# EAGLE schematic lightfun (EAGLE 7.2.0)
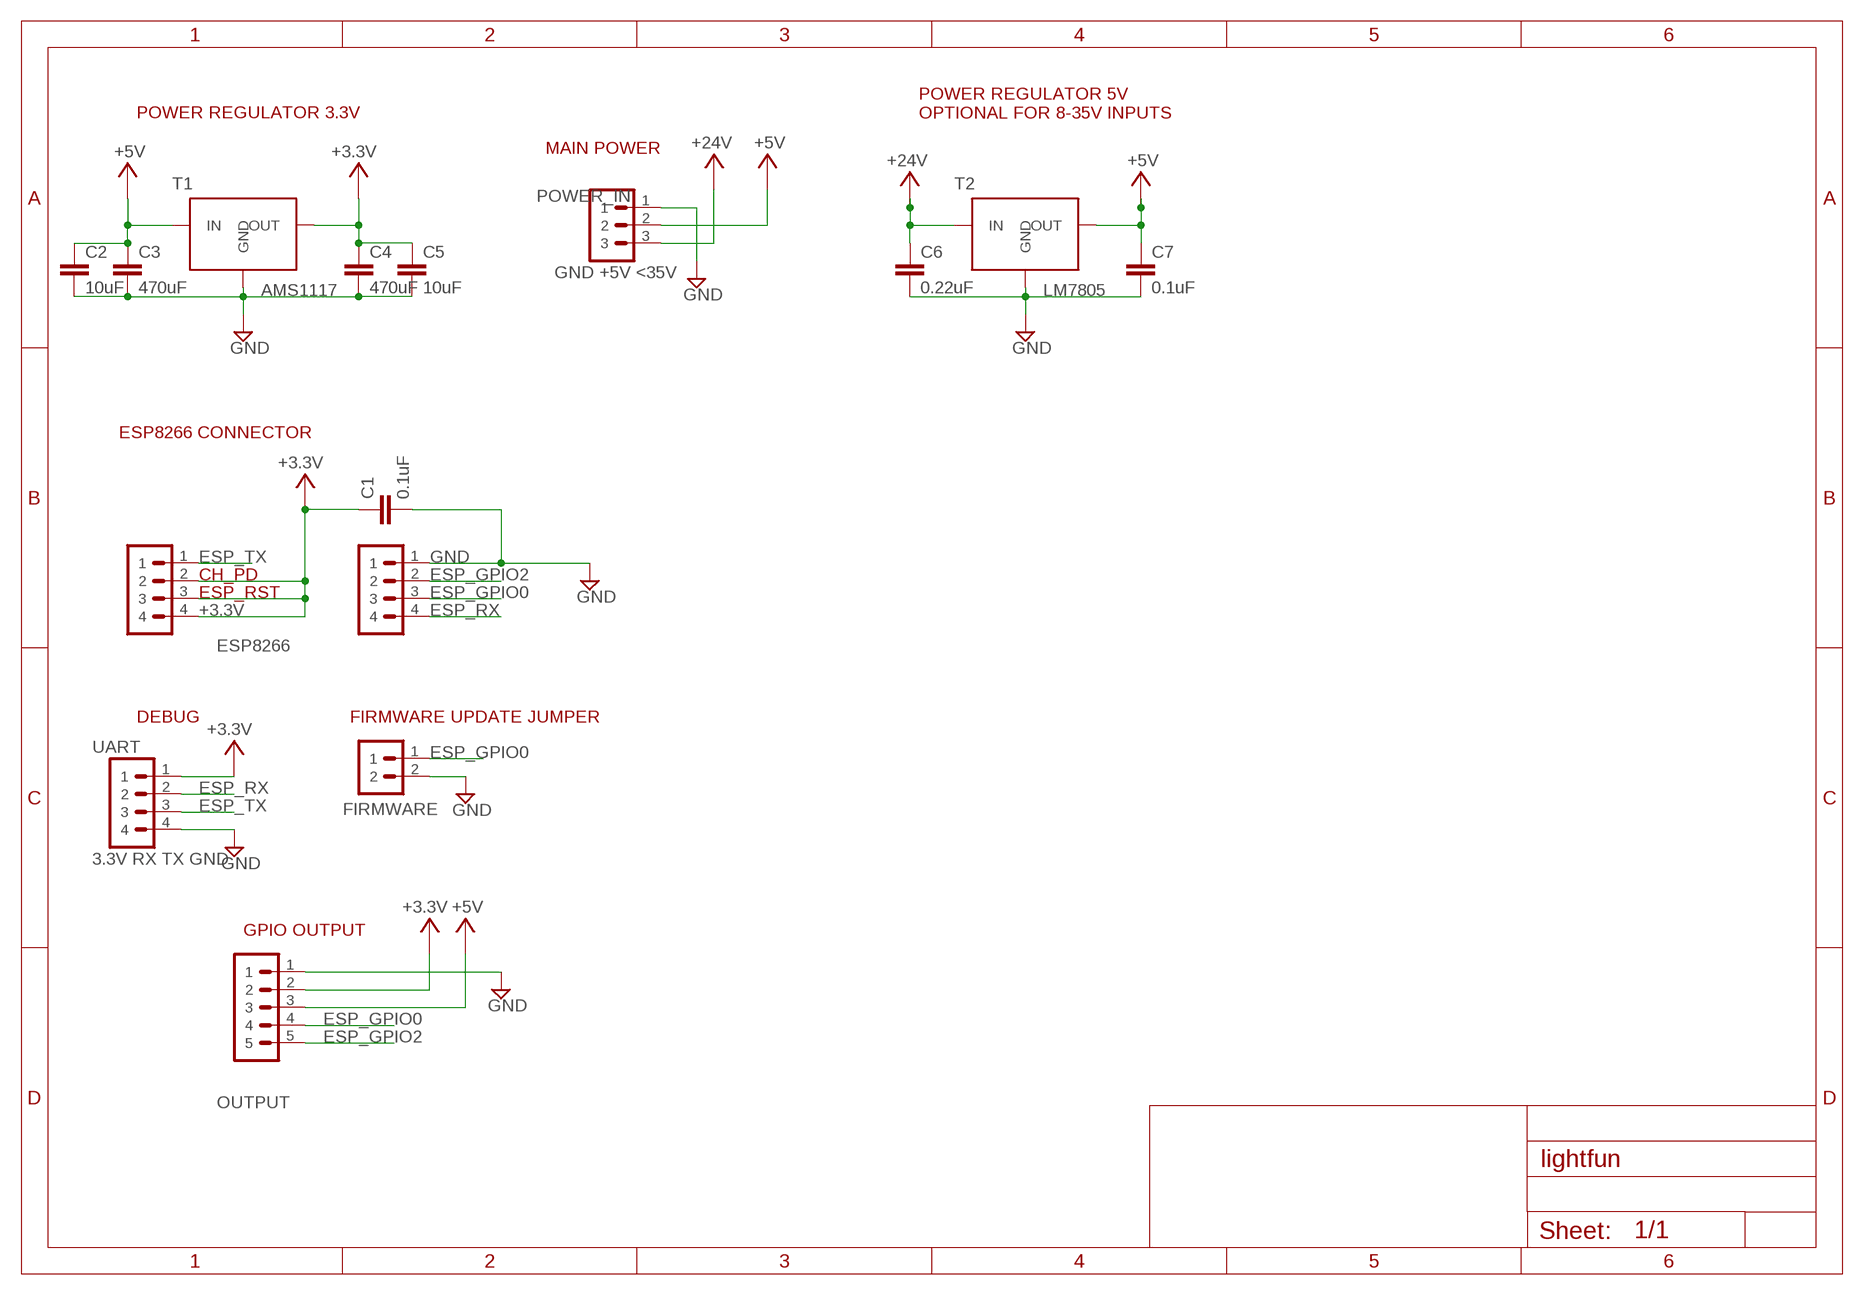
[diagram p0: schematic, sheet 1]

## Parts
C1  0.1uF  C2.5/2  [C2.5-2]
C2  10uF  C2.5/2  [C2.5-2]
C3  470uF  C2.5/2  [C2.5-2]
C4  470uF  C2.5/2  [C2.5-2]
C5  10uF  C2.5/2  [C2.5-2]
C6  0.22uF  C2.5/2  [C2.5-2]
C7  0.1uF  C2.5/2  [C2.5-2]
FIRMWARE  FIRMWARE  PIN-HEADER-2PIN  [PIN-HEADER-2PIN]
OUTPUT  GND 3.3V 5V IO0 IO2  PIN-HEADER-5PIN  [PIN-HEADER-5PIN]
P1  ESP8266  PIN-HEADER-4PIN  [PIN-HEADER-4PIN]
P2  ESP8266 CONNECTOR  PIN-HEADER-4PIN  [PIN-HEADER-4PIN]
POWER_IN  GND +5V <35V  PIN-HEADER-3PIN  [PIN-HEADER-3PIN]
T1  AMS1117  [SOT-223]
T2  LM7805  [TO-220]
UART  3.3V RX TX GND  PIN-HEADER-4PIN  [PIN-HEADER-4PIN]

## Nets
+3.3V [power-2A]: C1.1 C4.1 C5.1 OUTPUT.2 P1.2 P1.3 P1.4 T1.2(OUT) UART.1
+5V [power-2A]: C2.1 C3.1 C7.1 OUTPUT.3 POWER_IN.2 T1.3(IN) T2.OUTPUT(OUT)
+24V [power-2A]: C6.1 POWER_IN.3 T2.INPUT(IN)
ESP_GPIO0: FIRMWARE.1 OUTPUT.4 P2.3
ESP_GPIO2: OUTPUT.5 P2.2
ESP_RX: P2.4 UART.2
ESP_TX: P1.1 UART.3
GND [power-2A]: C1.2 C2.2 C3.2 C4.2 C5.2 C6.2 C7.2 FIRMWARE.2 OUTPUT.1 P2.1 POWER_IN.1 T1.1(GND) T2.GND UART.4

## Notes on the sheet
- POWER REGULATOR 3.3V
- POWER REGULATOR 5V
  OPTIONAL FOR 8-35V INPUTS
- MAIN POWER
- ESP8266 CONNECTOR
- CH_PD
- ESP_RST
- DEBUG | FIRMWARE UPDATE JUMPER
- GPIO OUTPUT

## Library data of the parts
C1 C2 C5 = capacitor-wima:C: CAPACITOR naming: grid - package width
C3 C6 = capacitor-wima:C: CAPACITOR naming: grid - package width; MPN: 1C10Z5U104M050B
C4 C7 = capacitor-wima:C: CAPACITOR naming: grid - package width; MPN: FK18X5R0J106M
FIRMWARE = stutz-eagle:PIN-HEADER-2PIN
OUTPUT = stutz-eagle:PIN-HEADER-5PIN
P1 P2 UART = stutz-eagle:PIN-HEADER-4PIN
POWER_IN = stutz-eagle:PIN-HEADER-3PIN
T1 = stutz-eagle:AMS1117; MPN: LM2937ET-3.3
T2 = stutz-eagle:LM7805; MPN: LM2937ET-3.3

## Net classes
0 default: clearance 0.355 mm
1 power-4A: width 2.642 mm
2 comm-rs485: width 1.016 mm
3 power-2A: width 1.143 mm